# Altium schematic sheet H_Bridge.SchDoc
size A3; SheetNumber: 5; SheetTotal: 5
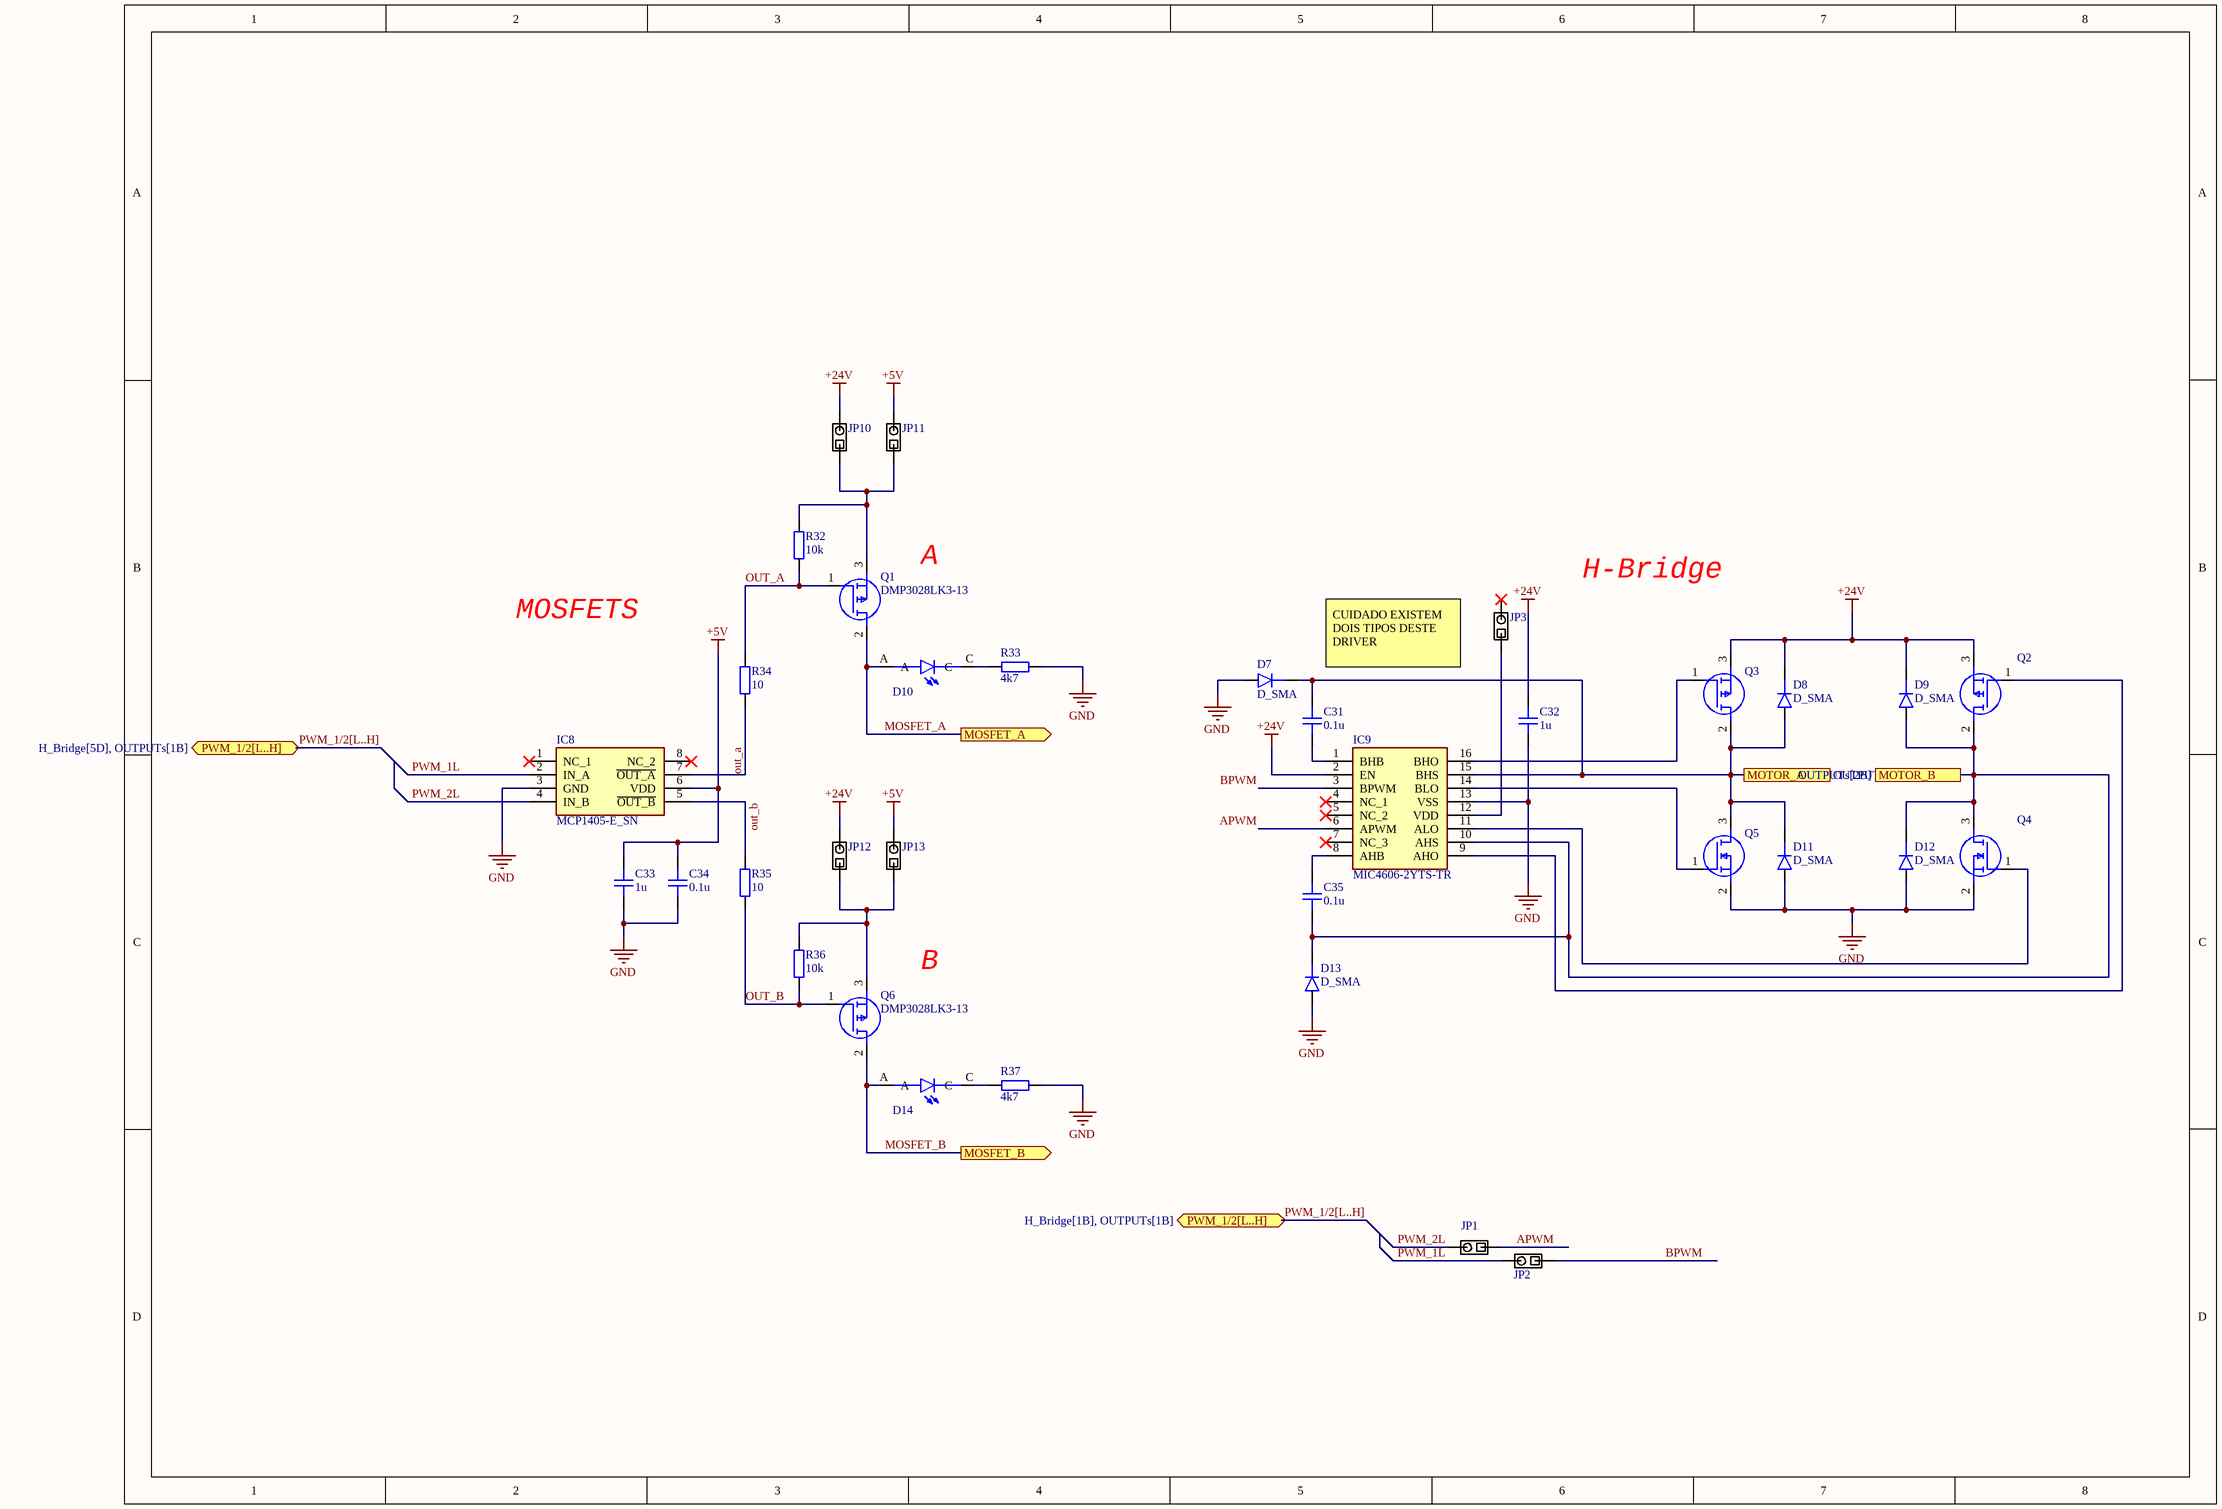
[diagram p0: H_Bridge.SchDoc]

## Parts
C31  0.1u  [CAP_0805]
C32  1u  [CAP_0805]
C33  1u  [CAP_0805]
C34  0.1u  [CAP_0805]
C35  0.1u  [CAP_0805]
D7  D_SMA  [DO-214AC-2 (SMA)]
D8  D_SMA  [DO-214AC-2 (SMA)]
D9  D_SMA  [DO-214AC-2 (SMA)]
D10  SML-LXT0805IW-TR  [LEDC2012X120N]  (value not drawn)
D11  D_SMA  [DO-214AC-2 (SMA)]
D12  D_SMA  [DO-214AC-2 (SMA)]
D13  D_SMA  [DO-214AC-2 (SMA)]
D14  SML-LXT0805IW-TR  [LEDC2012X120N]  (value not drawn)
IC8  MCP1405-E_SN  [SOIC127P600X175-8N]
IC9  MIC4606-2YTS-TR  [SOP65P640X120-16N]
JP1  Solder Jumper  [SolderJumper_Single]  (value not drawn)
JP2  Solder Jumper  [SolderJumper_Single]  (value not drawn)
JP3  Solder Jumper  [SolderJumper_Single]  (value not drawn)
JP10  Solder Jumper  [SolderJumper_Single]  (value not drawn)
JP11  Solder Jumper  [SolderJumper_Single]  (value not drawn)
JP12  Solder Jumper  [SolderJumper_Single]  (value not drawn)
JP13  Solder Jumper  [SolderJumper_Single]  (value not drawn)
Q1  DMP3028LK3-13  [DMP3028LK313]
Q2  DMP3028LK3-13  [DMP3028LK313]  (value not drawn)
Q3  DMP3028LK3-13  [DMP3028LK313]  (value not drawn)
Q4  NVD5C478NT4G  [DPAK_(SINGLE-GAUGE)_TO-252(369C)_ISSUE_F]  (value not drawn)
Q5  NVD5C478NT4G  [DPAK_(SINGLE-GAUGE)_TO-252(369C)_ISSUE_F]  (value not drawn)
Q6  DMP3028LK3-13  [DMP3028LK313]
R32  10k  [RES_0805]
R33  4k7  [RES_0805]
R34  10  [RES_0805]
R35  10  [RES_0805]
R36  10k  [RES_0805]
R37  4k7  [RES_0805]

## Ports
MOSFET_A (out, see OUTPUTs[1B]), MOSFET_B (out, see OUTPUTs[2B]), MOTOR_A (see OUTPUTs[1B]), MOTOR_B (see OUTPUTs[2B]), PWM_1/2[L..H] (bidir, see H_Bridge[1B], OUTPUTs[1B]), PWM_1/2[L..H] (bidir, see H_Bridge[5D], OUTPUTs[1B])

## Nets
+5V: C33.2 C34.2 IC8.6(VDD) JP11.2 JP13.2
+24V: C32.1 D8.K D9.K IC9.2(EN) JP10.2 JP12.2 Q2.3(S) Q3.3(S)
GND: C32.2 C33.1 C34.1 D7.A D11.A D12.A D13.A IC8.3(GND) IC9.13(VSS) Q4.2(S) Q5.2(S) R33.1 R37.1
APWM: IC9.6(APWM) JP1.1
BPWM: IC9.3(BPWM) JP2.1
MOSFET_A: D10.A Q1.2(D) ; port MOSFET_A
MOSFET_B: D14.A Q6.2(D) ; port MOSFET_B
MOTOR_A: C31.2 D7.K D8.A D11.K IC9.15(BHS) Q3.2(D) Q5.3(D) ; port MOTOR_A
MOTOR_B: C35.2 D9.A D12.K D13.K IC9.10(AHS) Q2.2(D) Q4.3(D) ; port MOTOR_B
OUT_A: IC8.7(~{OUT_A}) Q1.1(G) R32.1 R34.1 R34.2
OUT_B: IC8.5(~{OUT_B}) Q6.1(G) R35.1 R35.2 R36.1
PWM_1L: IC8.2(IN_A) JP2.2
PWM_2L: IC8.4(IN_B) JP1.2
NetC31_1: C31.1 IC9.1(BHB)
NetC35_1: C35.1 IC9.8(AHB)
NetD10_C: D10.C R33.2
NetD14_C: D14.C R37.2
NetIC9_9: IC9.9(AHO) Q2.1(G)
NetIC9_11: IC9.11(ALO) Q4.1(G)
NetIC9_12: IC9.12(VDD) JP3.1
NetIC9_14: IC9.14(BLO) Q5.1(G)
NetIC9_16: IC9.16(BHO) Q3.1(G)
NetJP10_1: JP10.1 JP11.1 Q1.3(S) R32.2
NetJP12_1: JP12.1 JP13.1 Q6.3(S) R36.2

Not connected (* = marked no-connect by the designer): IC8 1(NC_1)* 8(NC_2)*; IC9 4(NC_1)* 5(NC_2)* 7(NC_3)*; JP3 2*

## Buses and harness runs
bus PWM_1/2[L..H] = port PWM_1/2[L..H]

## Notes on the sheet
- A
- H-Bridge
- MOSFETS
- CUIDADO EXISTEM DOIS TIPOS DESTE DRIVER
- B

## Library data of the parts
C31-C35 = CAP_0805_10V: Capacitor SMD 0805 10V
D7-D9 D11-D13 = D_SMA: Diode SMD SMA (DO-214AA)
D10 D14 = SML-LXT0805IW-TR: Red - LED Indication - Discrete 2V 0805 (2012 Metric); MF: Lumex Opto/Components; Check_prices: https://www.snapeda.com/parts/SML-LXT0805IW-TR/Lumex+Opto%252FComponents+Inc./view-part/?ref=eda; Price: None; MP: SML-LXT0805IW-TR; SnapEDA_Link: https://www.snapeda.com/parts/SML-LXT0805IW-TR/Lumex+Opto%252FComponents+Inc./view-part/?ref=snap; Availability: In Stock; Value: *; Purchase-URL: https://pricing.snapeda.com/search/part/SML-LXT0805IW-TR/?ref=eda; Package: 0805 Lumex
IC8 = MCP1405-E_SN: Integrated Circuit; Manufacturer_Name: Microchip; Manufacturer_Part_Number: MCP1405-E/SN; Datasheet Link: https://datasheet.datasheetarchive.com/originals/distributors/SFDatasheet-4/sf-00090019.pdf; Height: 1.75mm; Mouser Part Number: 579-MCP1405-E/SN; Mouser Price/Stock: https://www.mouser.co.uk/ProductDetail/Microchip-Technology/MCP1405-E-SN?qs=usxtMOJb1Rz6iJkGGONxgg%3D%3D; Arrow Part Number: MCP1405-E/SN; Arrow Price/Stock: https://www.arrow.com/en/products/mcp1405-esn/microchip-technology
IC9 = MIC4606-2YTS-TR: Integrated Circuit; Manufacturer_Name: Microchip; Datasheet Link: https://eu.mouser.com/datasheet/2/268/20005604B-1286645.pdf; Height: 1.2mm; Manufacturer_Part_Number: MIC4606-2YTS-TR; Mouser Part Number: 579-MIC4606-2YTS-TR; Mouser Price/Stock: https://www.mouser.co.uk/ProductDetail/Microchip-Technology-Atmel/MIC4606-2YTS-TR?qs=fxR7EJxuiMGiGNq6G0IdXQ%3D%3D; Arrow Part Number: MIC4606-2YTS-TR; Arrow Price/Stock: https://www.arrow.com/en/products/mic4606-2yts-tr/microchip-technology?region=nac
JP1-JP3 JP10-JP13 = SolderJumper_Single: Solder Jumper Single 0.5mm Pitch
Q1-Q3 Q6 = DMP3028LK3-13: MOSFET (P-Channel); Manufacturer_Name: Diodes Inc.; Datasheet Link: https://componentsearchengine.com/Datasheets/1/DMP3028LK3-13.pdf; Height: 2.39mm; Manufacturer_Part_Number: DMP3028LK3-13; Mouser Part Number: 621-DMP3028LK3-13; Mouser Price/Stock: https://www.mouser.co.uk/ProductDetail/Diodes-Incorporated/DMP3028LK3-13?qs=OVC8WVYZliSFpRP3sPErZQ%3D%3D; Arrow Part Number: DMP3028LK3-13; Arrow Price/Stock: https://www.arrow.com/en/products/dmp3028lk3-13/diodes-incorporated
Q4 Q5 = NVD5C478NT4G: MOSFET (N-Channel); Manufacturer_Name: onsemi; Datasheet Link: http://www.onsemi.com/pub/Collateral/NVD5C478N-D.PDF; Manufacturer_Part_Number: NVD5C478NT4G; Mouser Part Number: 863-NVD5C478NT4G; Mouser Price/Stock: https://www.mouser.co.uk/ProductDetail/ON-Semiconductor/NVD5C478NT4G/?qs=y6ZabgHbY%252Bxvq0EyOcHTlg%3D%3D; Arrow Part Number: NVD5C478NT4G; Arrow Price/Stock: https://www.arrow.com/en/products/nvd5c478nt4g/on-semiconductor?region=nac
R32-R37 = RES_0805: Resistor SMD 0805